# EAGLE design pendulum_input_board (EAGLE 9.4.2)
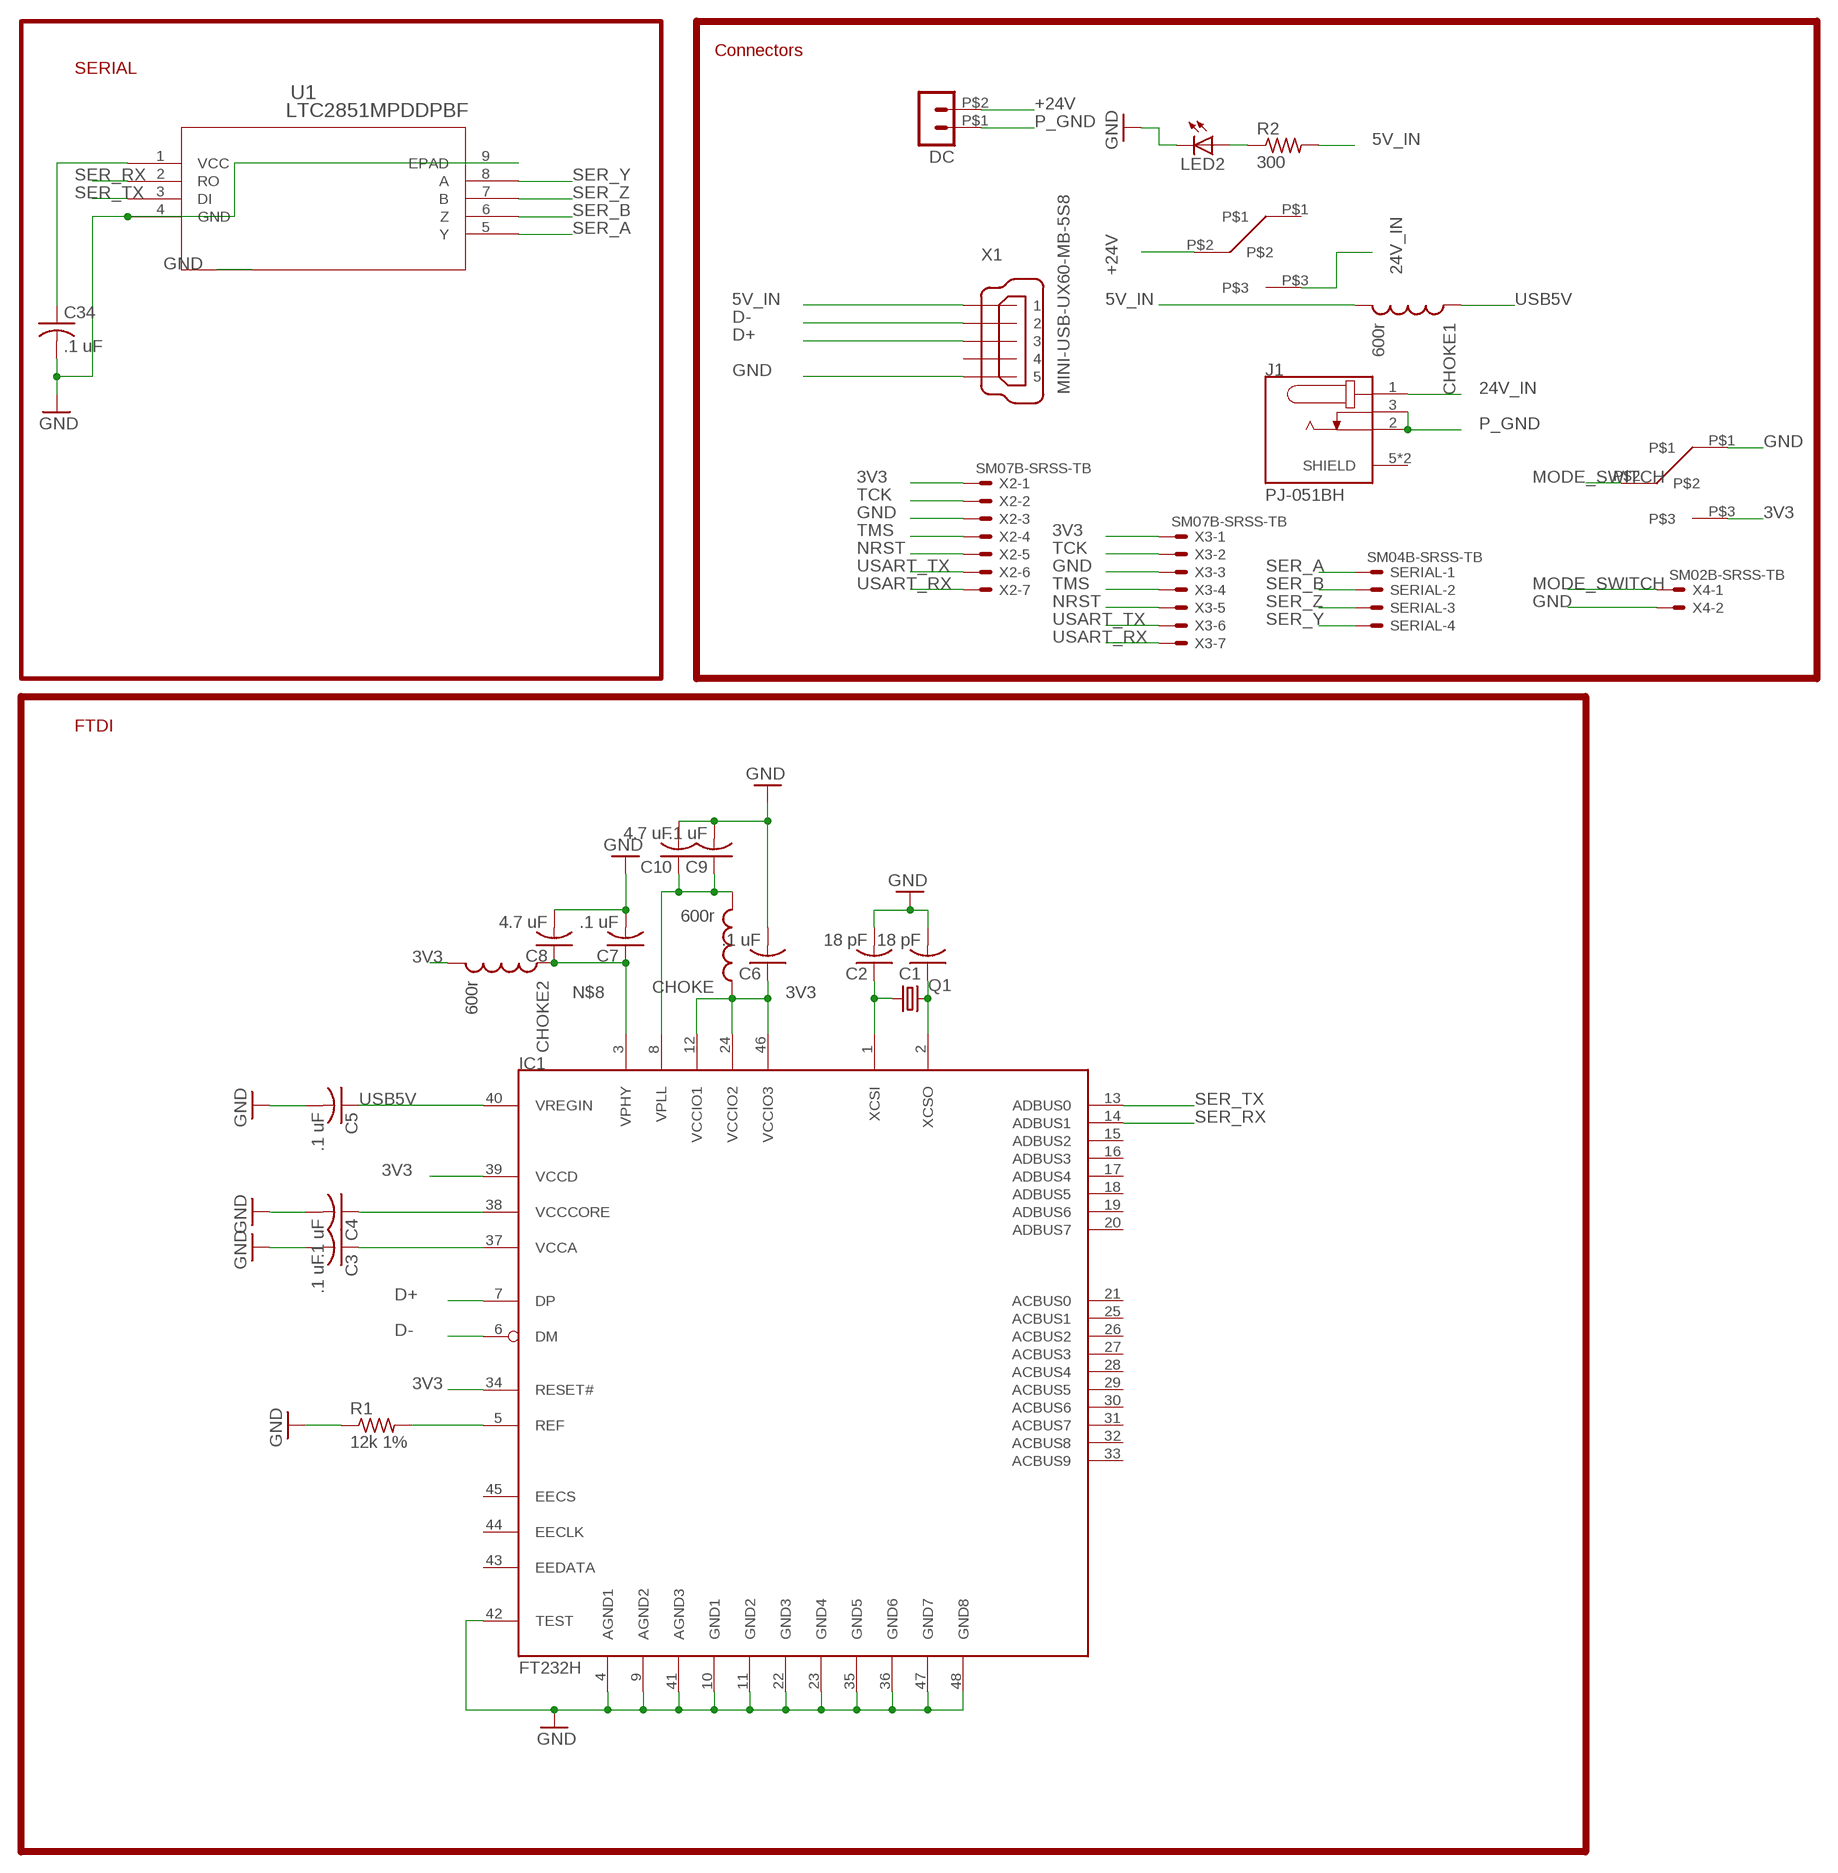
[diagram p0: schematic, sheet 1]

## Parts
C1  18 pF  C-USC0402K  [C0402K]
C2  18 pF  C-USC0402K  [C0402K]
C3  .1 uF  C-USC0402K  [C0402K]
C4  .1 uF  C-USC0402K  [C0402K]
C5  .1 uF  C-USC0402K  [C0402K]
C6  .1 uF  C-USC0402K  [C0402K]
C7  .1 uF  C-USC0402K  [C0402K]
C8  4.7 uF  C-USC0402K  [C0402K]
C9  .1 uF  C-USC0402K  [C0402K]
C10  4.7 uF  C-USC0402K  [C0402K]
C34  .1 uF  C-USC0402K  [C0402K]
CHOKE  600r  INDUCTOR0603  [0603]
CHOKE1  600r  INDUCTOR0603  [0603]
CHOKE2  600r  INDUCTOR0603  [0603]
DC  HEADER_POS2_43650-0200  [43650-0200]
IC1  FT232H  [LQFP48]
J1  PJ-051BH  [CUI_PJ-051BH]
LED2  LEDCHIP-LED0603  [CHIP-LED0603]
Q1  CRYSTALCTS406  [CTS406]
R1  12k 1%  R-US_R0402  [R0402]
R2  300  R-US_R0402  [R0402]
SERIAL  SM04B-SRSS-TB  [SM04B-SRSS-TB]
U1  LTC2851MPDDPBF  [DFN-8_DD]
U$2  SPDT  [100SP]
U$3  SPDT  [100SP]
X1  MINI-USB-UX60-MB-5S8  [UX60-MB-5S8]
X2  SM07B-SRSS-TB  [SM07B-SRSS-TB]
X3  SM07B-SRSS-TB  [SM07B-SRSS-TB]
X4  SM02B-SRSS-TB  [SM02B-SRSS-TB]

## Nets
3V3: C6.1 C34.1 CHOKE2.2 CHOKE.1 IC1.12(VCCIO1) IC1.24(VCCIO2) IC1.34(RESET#) IC1.39(VCCD) IC1.46(VCCIO3) U1.1(VCC) U$3.P$3 X2.1 X3.1
5V_IN: CHOKE1.2 R2.2 X1.1
24V_IN: J1.1 U$2.P$3
+24V: DC.P$2 U$2.P$2
D+: IC1.7(DP) X1.3
D-: IC1.6(DM) X1.2
GND: C1.2 C2.2 C3.2 C4.2 C5.2 C6.2 C7.2 C8.2 C9.2 C10.2 C34.2 IC1.4(AGND1) IC1.9(AGND2) IC1.10(GND1) IC1.11(GND2) IC1.22(GND3) IC1.23(GND4) IC1.35(GND5) IC1.36(GND6) IC1.41(AGND3) IC1.42(TEST) IC1.47(GND7) IC1.48(GND8) LED2.C R1.1 U1.4(GND) U1.9(EPAD) U$3.P$1 X1.5 X2.3 X3.3 X4.2
MODE_SWITCH: U$3.P$2 X4.1
N$1: C9.1 C10.1 CHOKE.2 IC1.8(VPLL)
N$2: IC1.5(REF) R1.2
N$3: C2.1 IC1.1(XCSI) Q1.1
N$4: C1.1 IC1.2(XCSO) Q1.3
N$5: C4.1 IC1.38(VCCCORE)
N$6: C3.1 IC1.37(VCCA)
N$8: C7.1 C8.1 CHOKE2.1 IC1.3(VPHY)
N$9: LED2.A R2.1
NRST: X2.5 X3.5
P_GND: DC.P$1 J1.2 J1.3
SER_A: SERIAL.1 U1.5(Y)
SER_B: SERIAL.2 U1.6(Z)
SER_RX: IC1.14(ADBUS1) U1.2(RO)
SER_TX: IC1.13(ADBUS0) U1.3(DI)
SER_Y: SERIAL.4 U1.8(A)
SER_Z: SERIAL.3 U1.7(B)
TCK: X2.2 X3.2
TMS: X2.4 X3.4
USART_RX: X2.7 X3.7
USART_TX: X2.6 X3.6
USB5V: C5.1 CHOKE1.1 IC1.40(VREGIN)
Unconnected: IC1.15(ADBUS2) IC1.16(ADBUS3) IC1.17(ADBUS4) IC1.18(ADBUS5) IC1.19(ADBUS6) IC1.20(ADBUS7) IC1.21(ACBUS0) IC1.25(ACBUS1) IC1.26(ACBUS2) IC1.27(ACBUS3) IC1.28(ACBUS4) IC1.29(ACBUS5) IC1.30(ACBUS6) IC1.31(ACBUS7) IC1.32(ACBUS8) IC1.33(ACBUS9) IC1.43(EEDATA) IC1.44(EECLK) IC1.45(EECS) J1.5(SHIELD) J1.6(SHIELD) U$2.P$1 X1.4

## Notes on the sheet
- Connectors
- SERIAL
- FTDI

## Library data of the parts
C1-C10 C34 = rcl:C-US: CAPACITOR, American symbol
CHOKE CHOKE1 CHOKE2 = SparkFun-Passives:INDUCTOR: Inductors Basic Inductor/Choke - 0603 and 1206. Footprints are not proven and vary greatly between part numbers. INDUCTOR POWER 3.3UH 4.0A SMD 0.197" L x 0.197" W x 0.177" H (5.00mm x 5.00mm x 4.50mm)
DC = con-molex-micro-fit-3_0:HEADER_POS2_?: Molex - Micro-Fit 3.0 Series connector, 3.00mm (0.118") pitch header, 2 positions.
IC1 = ftdichip-6:FT232H: FTDI FT232H High Speed USB 2.0 Slave Controller
J1 = PJ-051BH:PJ-051BH: 2.5 mm Center Pin, 5.0 A, Right Angle, Through Hole, Shielded, Dc Power Jack Connector; MANUFACTURER: CUI; PARTREV: 1.03; STANDARD: Manufacturer Recommendations
LED2 = led:LED: LED OSRAM: - CHIPLED LG R971, LG N971, LY N971, LG Q971, LY Q971, LO R971, LY R971 LH N974, LH R974 LS Q976, LO Q976, LY Q976 LO Q996 - Hyper CHIPLED LW Q18S LB Q993, LB Q99A, LB R99A - SideLED LS A670, LO A670, LY A670, LG A670, LP A670 LB A673, LV A673, LT A673, LW A673 LH A674 LY A675 LS A676, LA A676, LO A676, LY A676, LW A676 LS A679, LY A679, LG A679 - Hyper Micro SIDELED® LS Y876, LA Y876, LO Y876, LY Y876 LT Y87S - SmartLED LW L88C, LW L88S LB L89C, LB L89S, LG L890 LS L89K, LO L89K, LY L89K LS L896, LA L896, LO L896, LY L896 - TOPLED LS T670, LO T670, LY T670, LG T670, LP T670 LSG T670, LSP T670, LSY T670, LOP T670, LYG T670 LG T671, LOG T671, LSG T671 LB T673, LV T673, LT T673, LW T673 LH T674 LS T676, LA T676, LO T676, LY T676, LB T676, LH T676, LSB T676, LW T676 LB T67C, LV T67C, LT T67C, LS T67K, LO T67K, LY T67K, LW E67C LS E67B, LA E67B, LO E67B, LY E67B, LB E67C, LV E67C, LT E67C LW T67C LS T679, LY T679, LG T679 LS T770, LO T770, LY T770, LG T770, LP T770 LB T773, LV T773, LT T773, LW T773 LH T774 LS E675, LA E675, LY E675, LS T675 LS T776, LA T776, LO T776, LY T776, LB T776 LHGB T686 LT T68C, LB T68C - Hyper Mini TOPLED® LB M676 - Mini TOPLED Santana® LG M470 LS M47K, LO M47K, LY M47K Source: http://www.osram.convergy.de LUXEON: - LUMILED® LXK2-PW12-R00, LXK2-PW12-S00, LXK2-PW14-U00, LXK2-PW14-V00 LXK2-PM12-R00, LXK2-PM12-S00, LXK2-PM14-U00 LXK2-PE12-Q00, LXK2-PE12-R00, LXK2-PE12-S00, LXK2-PE14-T00, LXK2-PE14-U00 LXK2-PB12-K00, LXK2-PB12-L00, LXK2-PB12-M00, LXK2-PB14-N00, LXK2-PB14-P00, LXK2-PB14-Q00 LXK2-PR12-L00, LXK2-PR12-M00, LXK2-PR14-Q00, LXK2-PR14-R00 LXK2-PD12-Q00, LXK2-PD12-R00, LXK2-PD12-S00 LXK2-PH12-R00, LXK2-PH12-S00 LXK2-PL12-P00, LXK2-PL12-Q00, LXK2-PL12-R00 Source: www.luxeon.com KINGBRIGHT: KA-3528ASYC Source: www.kingbright.com
Q1 = crystal:CRYSTAL: CRYSTAL; OC_FARNELL: unknown; OC_NEWARK: unknown
R1 R2 = rcl:R-US_: RESISTOR, American symbol
SERIAL = con-jst2:?M04B-SRSS-TB: Disconnectable Crimp style connector, 1.0mm pitch 4 contacts
U1 = LTC2851MPDDPBF:LTC2851MPDDPBF; DESCRIPTION: LTC2851 - 3.3V 20Mbps RS485/RS422 Transceiver; DIGI-KEY_PART_NUMBER: LTC2851MPDD#PBF-ND; DIGI-KEY_PURCHASE_URL: https://www.digikey.com/product-detail/en/linear-technology-analog-devices/LTC2851MPDD-PBF/LTC2851MPDD-PBF-ND/2297587?utm_source=snapeda&utm_medium=aggregator&utm_campaign=symbol; MF: Linear Technology; MP: LTC2851MPDD#PBF; PACKAGE: DFN-8 Linear Technology
U$2 U$3 = Ben_Library:SPDT
X1 = con-hirose:MINI-USB-: MINI USB Connector Source: http://www.hirose.co.jp/cataloge_hp/e24000019.pdf; OC_FARNELL: unknown; OC_NEWARK: unknown
X2 X3 = con-jst2:?M07B-SRSS-TB: Disconnectable Crimp style connector, 1.0mm pitch 7 contacts
X4 = con-jst2:?M02B-SRSS-TB: Disconnectable Crimp style connector, 1.0mm pitch 2 contacts

## Board
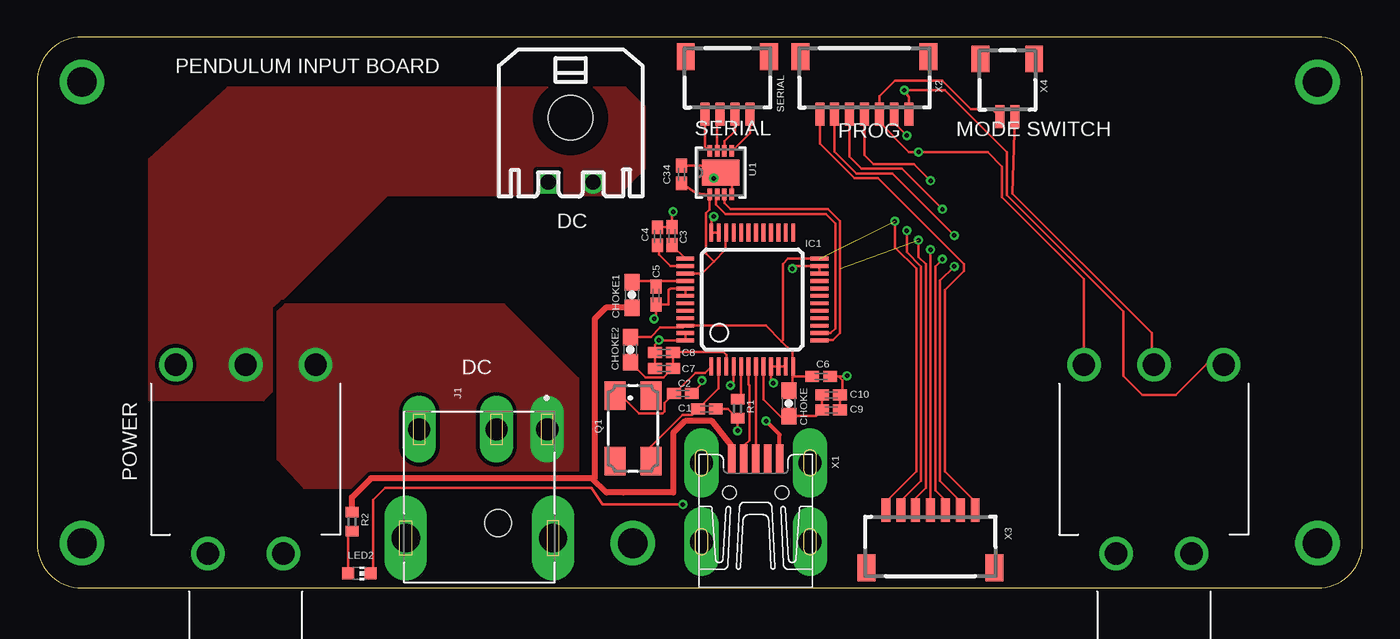
[diagram p1: board, top side]
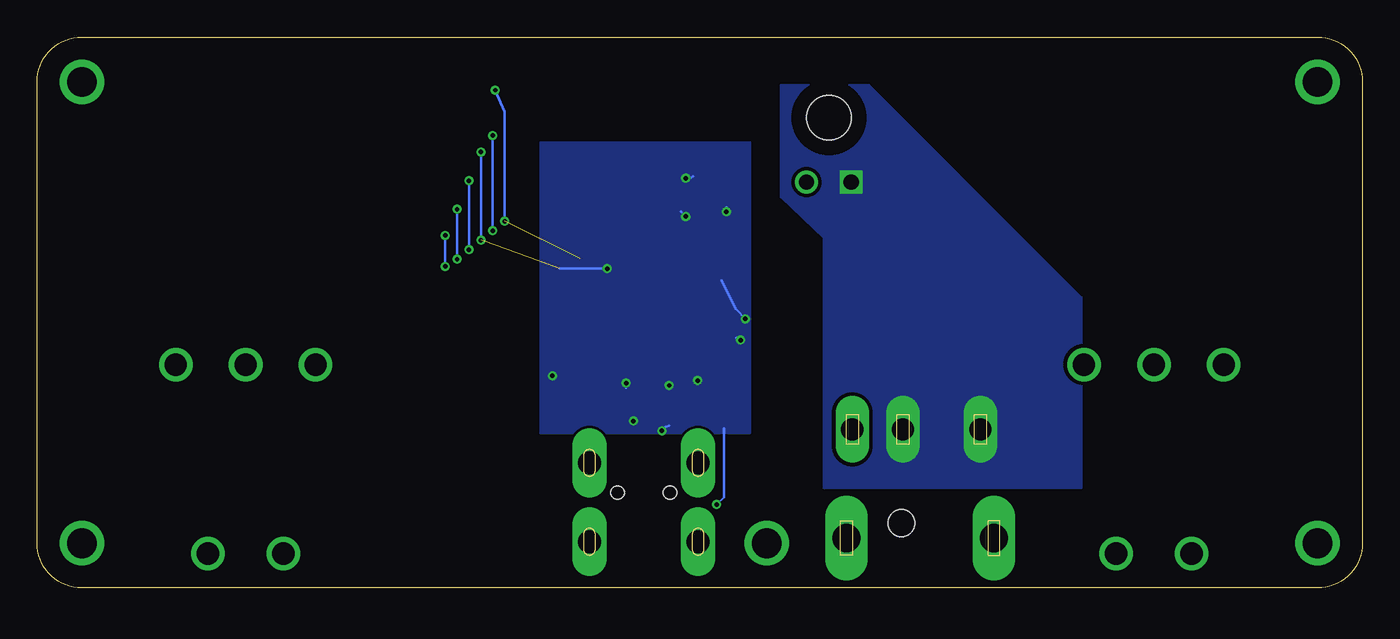
[diagram p2: board, bottom side, seen from below]

Size 89 x 37 mm. Coordinates in mm from the lower left corner, seen from the top.
Outline: 3,0 86,0 arc90 89,3 89,34 arc90 86,37 3,37 arc90 0,34 0,3 arc90 3,0
Copper layers (1*16): Top 0.035mm / dielectric 1.5mm / Bottom 0.035mm
Design rules "default *": minimum track width 6mil, minimum drill 0.3mm, track to track 6mil, track to pad 6mil, pad to pad 6mil, via to via 6mil, smd to smd 6mil, copper to edge 40mil, drill to drill 8mil, minimum pad ring 6mil, minimum via ring 6mil, stop-mask expansion 4mil, vias tented up to drill 0mil, thermal gap 10mil

### Footprints (pad centres in the part's own frame; a part is rotated, then mirrored left to right if it is on the bottom)
C0402K = smd 0.925 x 0.74: 1 -0.6,0; 2 0.6,0
0603 = smd 1.1 x 1: 1 -0.85,0; 2 0.85,0
43650-0200 = drill 1.02 square: P$1 1.5,4.32 | drill 1.02: P$2 -1.5,4.32 | hole 3: 0,0
LQFP48 = smd 0.25 x 1.2: 1 -2.75,-4.5; 2 -2.25,-4.5; 3 -1.75,-4.5; 4 -1.25,-4.5; 5 -0.75,-4.5; 6 -0.25,-4.5; 7 0.25,-4.5; 8 0.75,-4.5; 9 1.25,-4.5; 10 1.75,-4.5; 11 2.25,-4.5; 12 2.75,-4.5; 25 2.75,4.5; 26 2.25,4.5; 27 1.75,4.5; 28 1.25,4.5; 29 0.75,4.5; 30 0.25,4.5; 31 -0.25,4.5; 32 -0.75,4.5; 33 -1.25,4.5; 34 -1.75,4.5; 35 -2.25,4.5; 36 -2.75,4.5 | smd 1.2 x 0.25: 13 4.5,-2.75; 14 4.5,-2.25; 15 4.5,-1.75; 16 4.5,-1.25; 17 4.5,-0.75; 18 4.5,-0.25; 19 4.5,0.25; 20 4.5,0.75; 21 4.5,1.25; 22 4.5,1.75; 23 4.5,2.25; 24 4.5,2.75; 37 -4.5,2.75; 38 -4.5,2.25; 39 -4.5,1.75; 40 -4.5,1.25; 41 -4.5,0.75; 42 -4.5,0.25; 43 -4.5,-0.25; 44 -4.5,-0.75; 45 -4.5,-1.25; 46 -4.5,-1.75; 47 -4.5,-2.25; 48 -4.5,-2.75
CUI_PJ-051BH = drill 1.5 long: 1 -4.55,4.55; 2 -4.55,-4.05; 3 -4.55,1.15 | drill 1.9 long: 5 2.75,-4.95; 6 2.75,4.95 | hole 1.8: 1.75,1.25
CHIP-LED0603 = smd 0.8 x 0.8: A 0,-0.75; C 0,0.75
CTS406 = smd 1.9 x 1.4: 1 -2.2,-1.2; 2 2.2,-1.2; 3 2.2,1.2; 4 -2.2,1.2
R0402 = smd 0.7 x 0.9: 1 -0.65,0; 2 0.65,0
SM04B-SRSS-TB = smd 0.6 x 1.55: 1 -1.5,2.975; 2 -0.5,2.975; 3 0.5,2.975; 4 1.5,2.975 | smd 1.2 x 1.8: FIT@1 -2.8,-0.9; FIT@2 2.8,-0.9
DFN-8_DD = smd 0.787 x 0.305: 1 -1.46,0.75; 2 -1.46,0.25; 3 -1.46,-0.25; 4 -1.46,-0.75; 5 1.46,-0.75; 6 1.46,-0.25; 7 1.46,0.25; 8 1.46,0.75 | smd 1.753 x 2.489: 9 0,0
100SP = drill 1.5: P$1 4.699,0; P$2 0,0; P$3 -4.699,0; P$4 2.54,12.7; P$5 -2.54,12.7
UX60-MB-5S8 = smd 2 x 0.5: 1 8.65,1.6; 2 8.65,0.8; 3 8.65,0; 4 8.65,-0.8; 5 8.65,-1.6 | drill 1.55 long: M1 3.1,-3.65; M2 3.1,3.65; M3 8.4,3.65; M4 8.4,-3.65 | hole 0.9: 6.4,-1.75; 6.4,1.75
SM07B-SRSS-TB = smd 0.6 x 1.55: 1 -3,2.975; 2 -2,2.975; 3 -1,2.975; 4 0,2.975; 5 1,2.975; 6 2,2.975; 7 3,2.975 | smd 1.2 x 1.8: FIT@1 -4.3,-0.9; FIT@2 4.3,-0.9
SM02B-SRSS-TB = smd 0.6 x 1.55: 1 -0.5,2.975; 2 0.5,2.975 | smd 1.2 x 1.8: FIT@1 -1.8,-0.9; FIT@2 1.8,-0.9

### Placement (x,y rotation side)
C1  44.98,12.03 0 top
C2  43.37,13.06 0 top
C3  42.64,23.64 90 top
C4  41.67,23.62 90 top
C5  41.55,19.64 270 top
C6  52.66,14.19 0 top
C7  42.1,14.75 180 top
C8  42.1,15.83 180 top
C9  53.32,11.96 0 top
C10  53.32,12.96 0 top
C34  43.29,27.78 90 top
CHOKE  50.48,12.39 270 top
CHOKE1  39.94,19.68 270 top
CHOKE2  39.84,16 90 top
DC  35.83,31.59 180 top
IC1  48.03,19.37 0 top
J1  29.7,6.1 270 top
LED2  21.64,0.97 270 top
Q1  40.02,10.71 270 top
R1  47.04,12.04 90 top
R2  21.15,4.45 90 top
SERIAL  46.36,34.8 180 top
U1  45.91,27.9 90 top
U$2  14,15 180 top
U$3  75,15 180 top
X1  48.26,0 90 top
X2  55.56,34.8 180 top
X3  60,2.25 0 top
X4  65.16,34.64 180 top

### Tracks (layer width: path | path; a pad name or v marks a point on that pad's centre or on a via)
3V3  (via drill 0.3)  (1 unrouted)
  Top 0.152: U1.1 45.16,25.43 44.91,25.18 44.91,22.45 45.44,21.92
  Top 0.16: X3.1 56.96,5.26 56.96,5.76 59.04,7.84 59.04,21.44 57.6,22.88 v57.6,24.64 | X2.1 58.56,32.96 v58.24,33.44 60.96,33.44 65.12,29.28 65.12,26.4 72.96,18.56 72.96,14.24 74.24,12.96 76.48,12.96 78.52,15 U$3.P$3 | IC1.34 46.24,23.83 46.24,22.72 45.44,21.92 44.64,21.12 IC1.39 44.4,21.12 44.64,20.88 44.64,17.62 | 50.72,14.24 50.72,13.48 CHOKE.1 | 50.72,14.24 50.72,14.81 IC1.12 50.72,14.93 50.72,15.84 50,16.56 | 44.64,17.62 IC1.46 43.39,17.48 41.84,17.48 41.21,16.85 CHOKE2.2 | 44.64,17.62 48.94,17.62 50,16.56 | C6.1 50.77,14.19 50.72,14.24 | IC1.24 50.44,22.12 50.08,21.76 50.08,16.64 50,16.56 | C34.1 44.26,26.54 U1.1
  Bottom 0.16: v58.24,33.44 57.6,32 v57.6,24.64
5V_IN
  Top 0.405: 39.36,6.4 38.24,6.4 37.28,7.36
  Top 0.406: X1.1 46.66,9.5 45.33,11.2 43.52,11.2 42.72,10.4 42.72,6.4 39.36,6.4 | R2.2 21.15,6.09 22.42,7.36 37.28,7.36 37.44,7.36 37.44,18.08 38.19,18.83 CHOKE1.2
24V_IN
  pour Top (isolate 0.25, no thermals): 36.32,6.72 17.92,6.72 16.16,8.64 16.16,18.56 16.64,19.04 31.36,19.04 36.32,14.08
+24V
  pour Top (isolate 0.25, rank 2, no thermals): 7.52,12.64 7.52,28.8 12.8,33.6 39.52,33.6 40.8,32.32 40.8,28.16 39.04,26.4 23.52,26.4 15.84,18.72 15.84,13.28 15.2,12.64
D+
  Top 0.16: X1.3 48.26,14.85 IC1.7
D-
  Top 0.16: IC1.6 47.78,13.66 47.84,13.6 47.84,9.92 47.52,9.6 47.52,8.71 X1.2
GND  (via drill 0.3)  (1 unrouted)
  Top 0.152: C1.2 46.4,12.03 R1.1 | C5.2 41.55,18.19 v41.44,18.08
  Top 0.16: IC1.11 IC1.10 IC1.9 49.28,13.91 v49.43,13.76 v49.44,13.76 | R1.1 v47.04,10.56 | C2.2 44.64,13.73 v44.64,13.92 | IC1.4 46.78,13.82 v46.56,13.6 | X3.3 58.88,4.95 58.88,5.92 59.68,6.72 59.68,21.76 59.2,22.24 v59.2,23.36 | C7.2 C8.2 41.5,16.31 41.81,16.62 IC1.48 | IC1.47 IC1.48 | IC1.48 41.78,16.62 v41.76,16.64 | IC1.42 IC1.41 42.52,20.12 42.4,20 42.4,19.04 C5.2 | IC1.35 IC1.36 45.28,24.8 v45.44,24.96 | C9.2 C10.2 54.08,13.12 54.08,13.92 53.81,14.19 C6.2 54.35,14.19 v54.4,14.24 | v43.36,5.6 37.97,5.6 37.23,6.72 23.36,6.72 22.56,5.92 22.56,1.14 LED2.C | C4.2 41.69,24.24 C3.2 42.64,25.2 v42.72,25.28 | U1.4 46.66,27.1 46.24,27.52 v45.44,27.52 45.54,27.42 U1.9 45.27,28.38 C34.2 | IC1.22 IC1.23 50.54,21.62 v50.72,21.44 | U$3.P$1 70.3,20.74 64.8,26.24 64.8,28.32 63.84,29.28 v59.2,29.28 58.56,29.28 56.56,31.28 X2.3 56.56,33.04 57.6,34.08 60.8,34.08 62.72,32.16 64.11,32.16 X4.2
  Top 0.254: X1.5 49.86,10.3 v48.96,11.2
  Bottom 0.16: v47.04,10.56 46.8,10.8 46.56,10.88 | v46.56,13.6 46.4,13.44 | v59.2,29.28 v59.2,23.36 | 42.08,16.8 41.92,16.8 v41.76,16.64 | v41.44,18.08 42.08,18.72 43.04,20.64 | v45.44,24.96 45.76,25.28 | v49.44,13.76 49.44,13.44 | v54.4,14.24 54.56,14.4 | 42.88,10.72 42.88,6.08 v43.36,5.6 | v42.72,25.28 42.72,25.6 | v45.44,27.52 45.12,27.52 44.96,27.68 | v50.72,21.44 53.92,21.44
  pour Bottom (isolate 0.16, no thermals): 41.12,29.92 55.2,29.92 55.2,10.4 41.12,10.4
MODE_SWITCH
  Top 0.16: X4.1 65.5,26.5 74.88,17.12 74.88,15.12 U$3.P$2
N$1
  Top 0.16: IC1.8 48.78,12.66 50.19,11.25 CHOKE.2 52.3,11.54 C9.1 C10.1
N$2
  Top 0.16: IC1.5 47.28,12.61 R1.2
N$3
  Top 0.152: Q1.1 39.25,12.91 40.42,11.73 42.02,11.73 42.15,11.87 42.15,12.44 C2.1 42.77,13.28 43.03,13.28 44.2,14.45 44.86,14.45 IC1.1
N$4
  Top 0.152: Q1.3 41.22,9.51 43.34,11.63 43.98,11.63 C1.1 45.76,13.41 45.76,14.05
  Top 0.16: C1.1 44.55,11.84 44.64,12 | IC1.2 45.76,14.05 | 41.6,8.89 Q1.3
N$5
  Top 0.16: IC1.38 42.54,21.62 41.76,22.4 41.76,22.93 C4.1
N$6
  Top 0.16: IC1.37 42.64,23.01 C3.1
N$7  (via drill 2)
  other vias: 3,3
N$8
  Top 0.16: IC1.3 46.28,15.64 46.08,15.84 C8.1 C7.1 42.66,14.75 42.06,14.15 40.84,14.15 CHOKE2.1
N$9
  Top 0.16: R2.1 20.89,3.54 LED2.A
N$11  (via drill 2)
  other vias: 3,34
N$13  (via drill 2)
  other vias: 86,34
N$14  (via drill 2)
  other vias: 86,3
N$15  (via drill 2)
  other vias: 40,3
NRST  (via drill 0.3)
  Top 0.16: X3.5 61.12,5.34 61.12,5.76 60.32,6.56 60.32,21.6 v60.8,22.08 | 54.56,32.32 X2.5 54.56,28.96 55.36,28.16 58.08,28.16 v60.8,25.44
  Bottom 0.16: v60.8,25.44 v60.8,22.08
P_GND
  pour Bottom (isolate 0.25, rank 2, no thermals): 36.16,6.72 36.16,23.52 39.04,26.24 39.04,33.76 33.12,33.76 18.88,19.52 18.88,6.72
SER_A
  Top 0.152: SERIAL.1 47.86,30.56 U1.5
  Top 0.16: 47.84,31.8 SERIAL.1
SER_B
  Top 0.152: SERIAL.2 46.86,30.7 46.16,30 U1.6
SER_RX
  Top 0.16: IC1.14 53.28,17.12 53.6,17.44 53.6,24.48 52.96,25.12 46.24,25.12 45.6,25.76 45.6,26.38 U1.2
SER_TX
  Top 0.16: U1.3 46.16,25.84 46.56,25.44 53.12,25.44 53.92,24.64 53.92,17.12 53.44,16.64 52.55,16.64 IC1.13
SER_Y
  Top 0.16: SERIAL.4 44.86,29.66 U1.8
SER_Z
  Top 0.16: U1.7 45.66,31.62 SERIAL.3
TCK  (via drill 0.3)
  Top 0.16: X3.2 57.92,5.3 57.92,5.76 59.36,7.2 59.36,21.6 58.4,22.56 v58.4,24 | X2.2 57.56,31.24 v58.4,30.4
  Bottom 0.16: v58.4,30.4 v58.4,24
TMS  (via drill 0.3)
  Top 0.16: 55.56,31.8 X2.4 55.56,29.08 56.16,28.48 58.88,28.48 v60,27.36 | v60,22.72 X3.4
  Bottom 0.16: v60,27.36 v60,22.72
USART_RX
  Top 0.16: X3.7 62.88,5.34 62.88,5.92 60.96,7.84 60.96,20 62.24,21.28 62.24,21.76 56.48,27.52 54.88,27.52 52.56,29.84 X2.7
USART_TX  (via drill 0.3)
  Top 0.16: X3.6 62.08,5.3 62.08,5.76 60.64,7.2 60.64,20.64 v61.6,21.6 | v61.6,23.68 57.44,27.84 55.04,27.84 53.56,29.32 X2.6
  Bottom 0.16: v61.6,23.68 v61.6,21.6
USB5V
  Top 0.16: IC1.40 41.6,20.62 | 41.6,20.62 40.03,20.62 CHOKE1.1 | C5.1 41.6,20.29 41.6,20.62

### Text on the board
tNames: PENDULUM INPUT BOARD | MODE SWITCH | SERIAL | PROG | DC | DC | POWER